# EasyEDA Pro project STM32F103C8T6-V2.0最小系统板.epro

# Schematic Schematic1

## Sheets
1 core: Board Name: 最小系统板; Create Date: 2025-08-06; Page Name: core; Project Name: STM32F103C8T6最小系统板_V2.0; Schematic Name: Schematic1; Update Date: 2025-09-07; Company: 嘉立创EDA; Page Size: A4; Version: V1.0
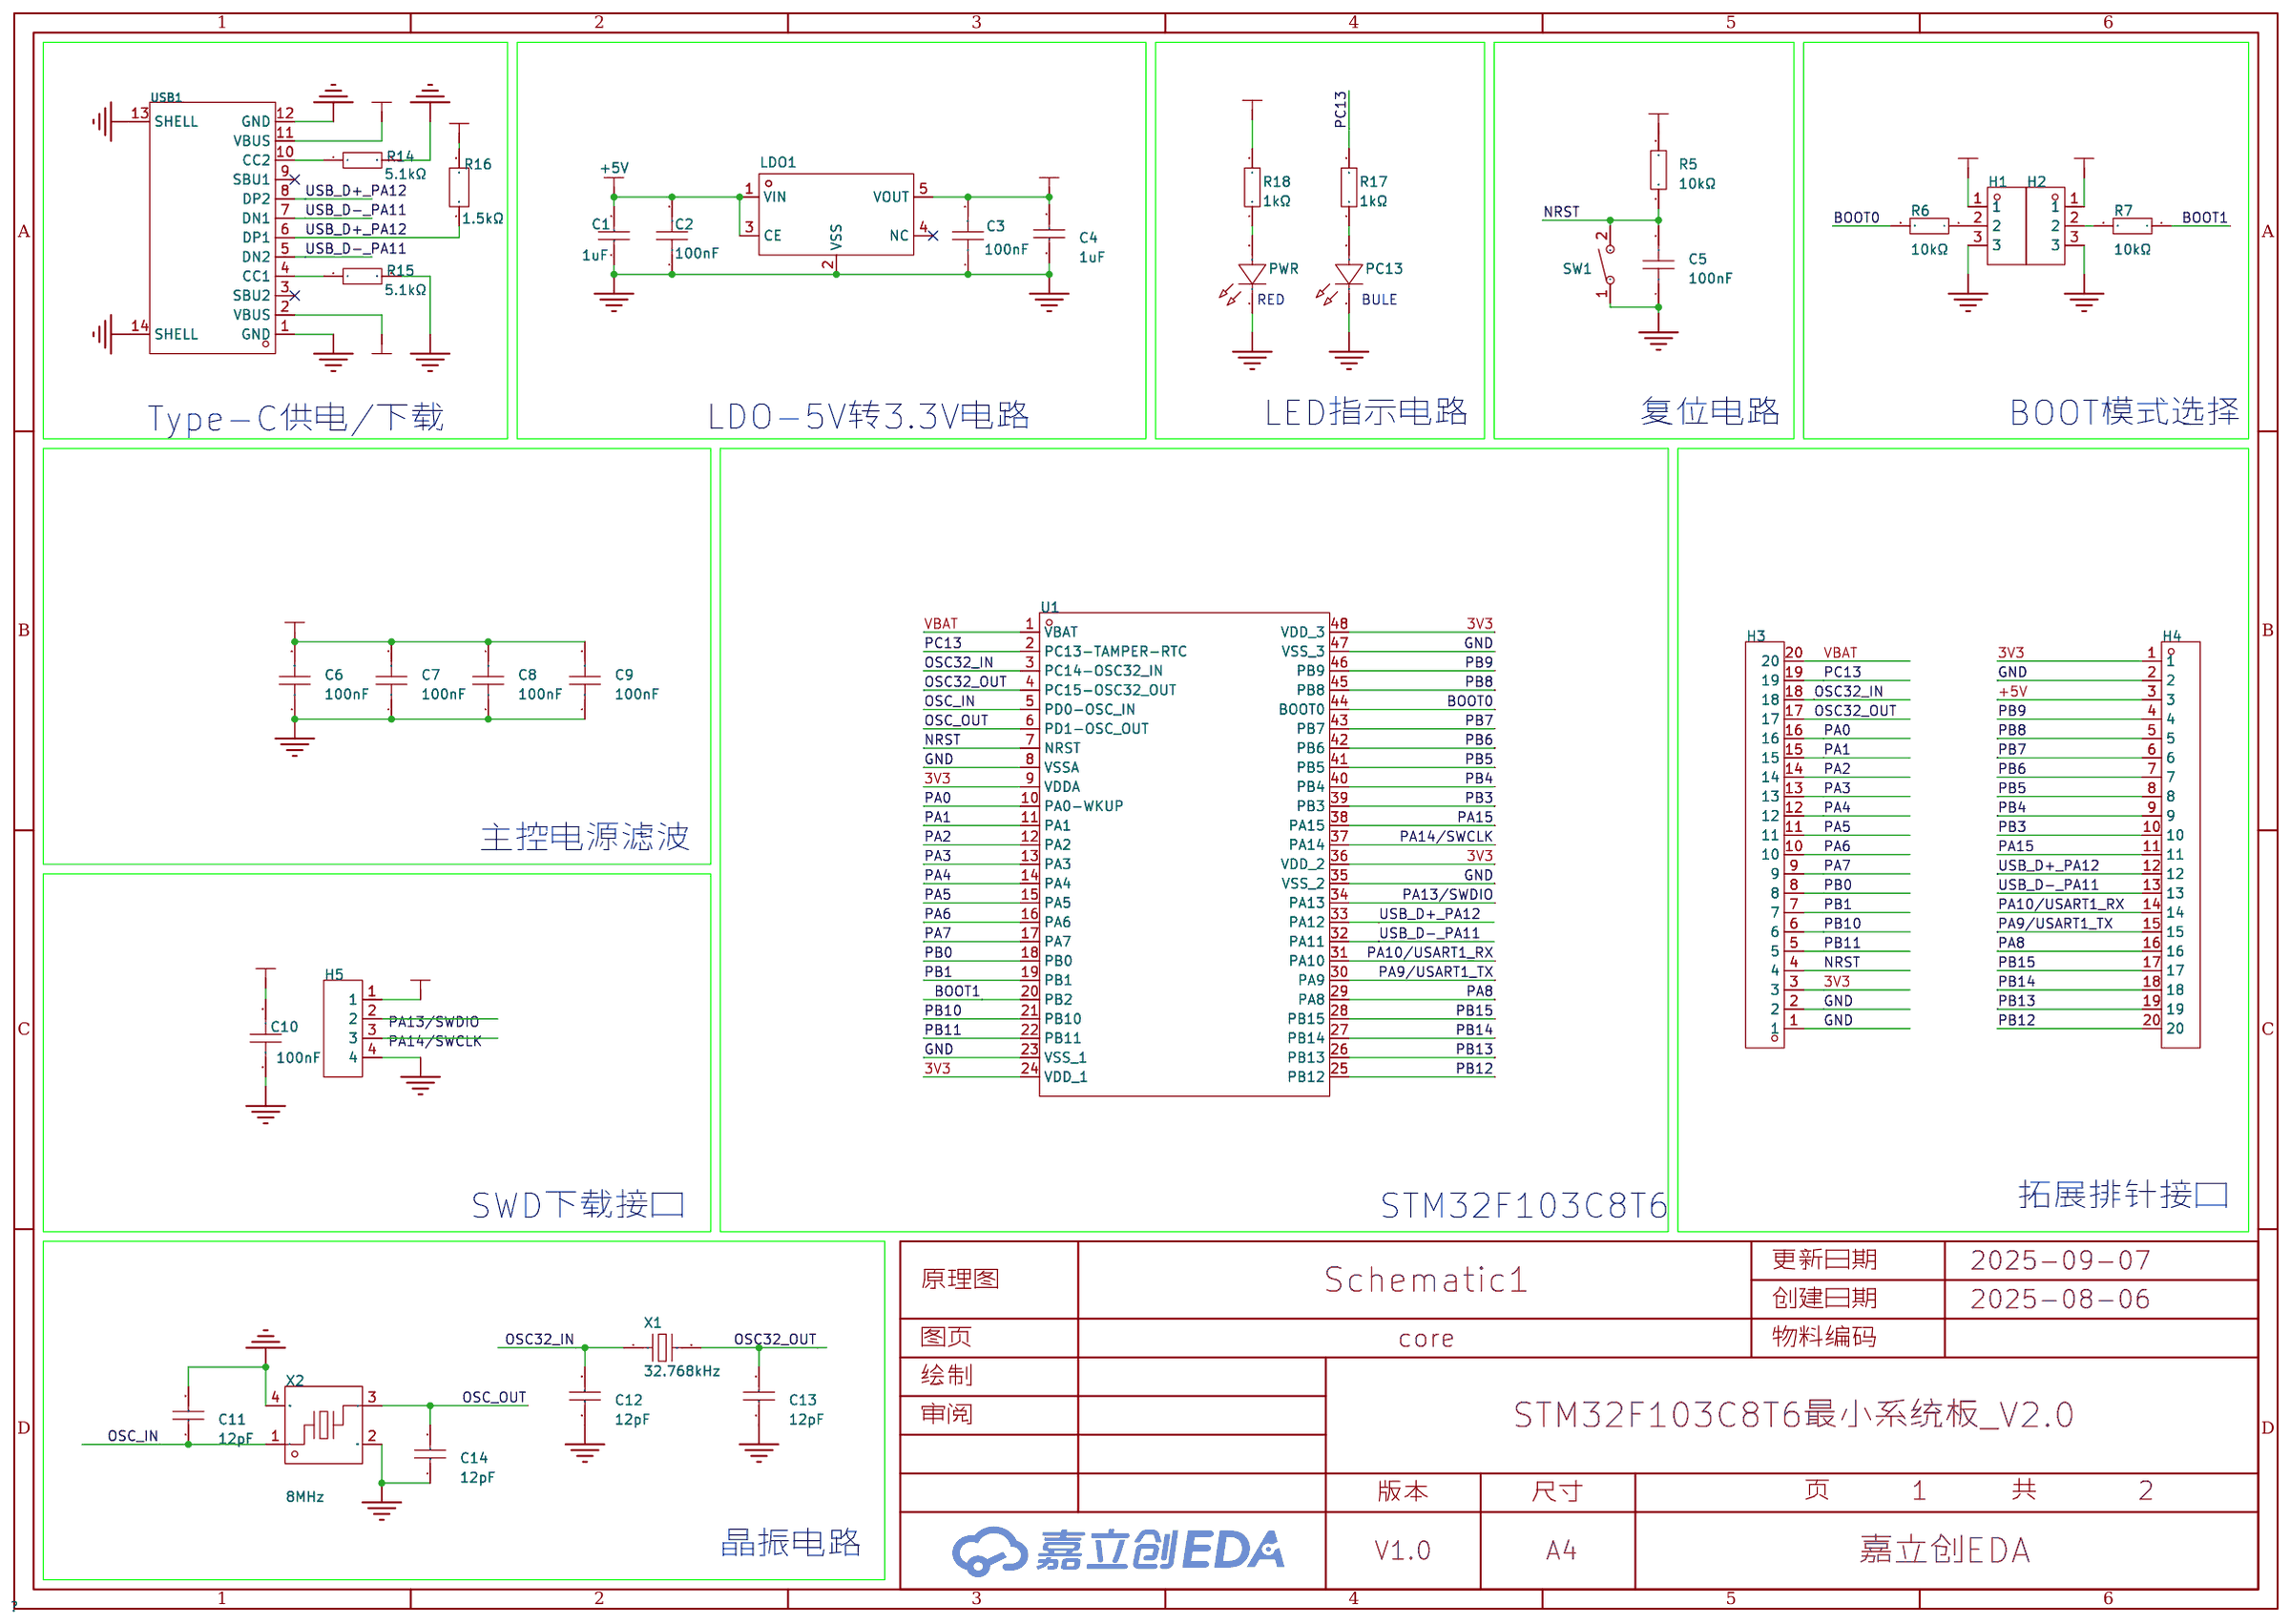
[diagram p0: core]
2 expand: Page Name: expand; Update Date: 2025-09-09
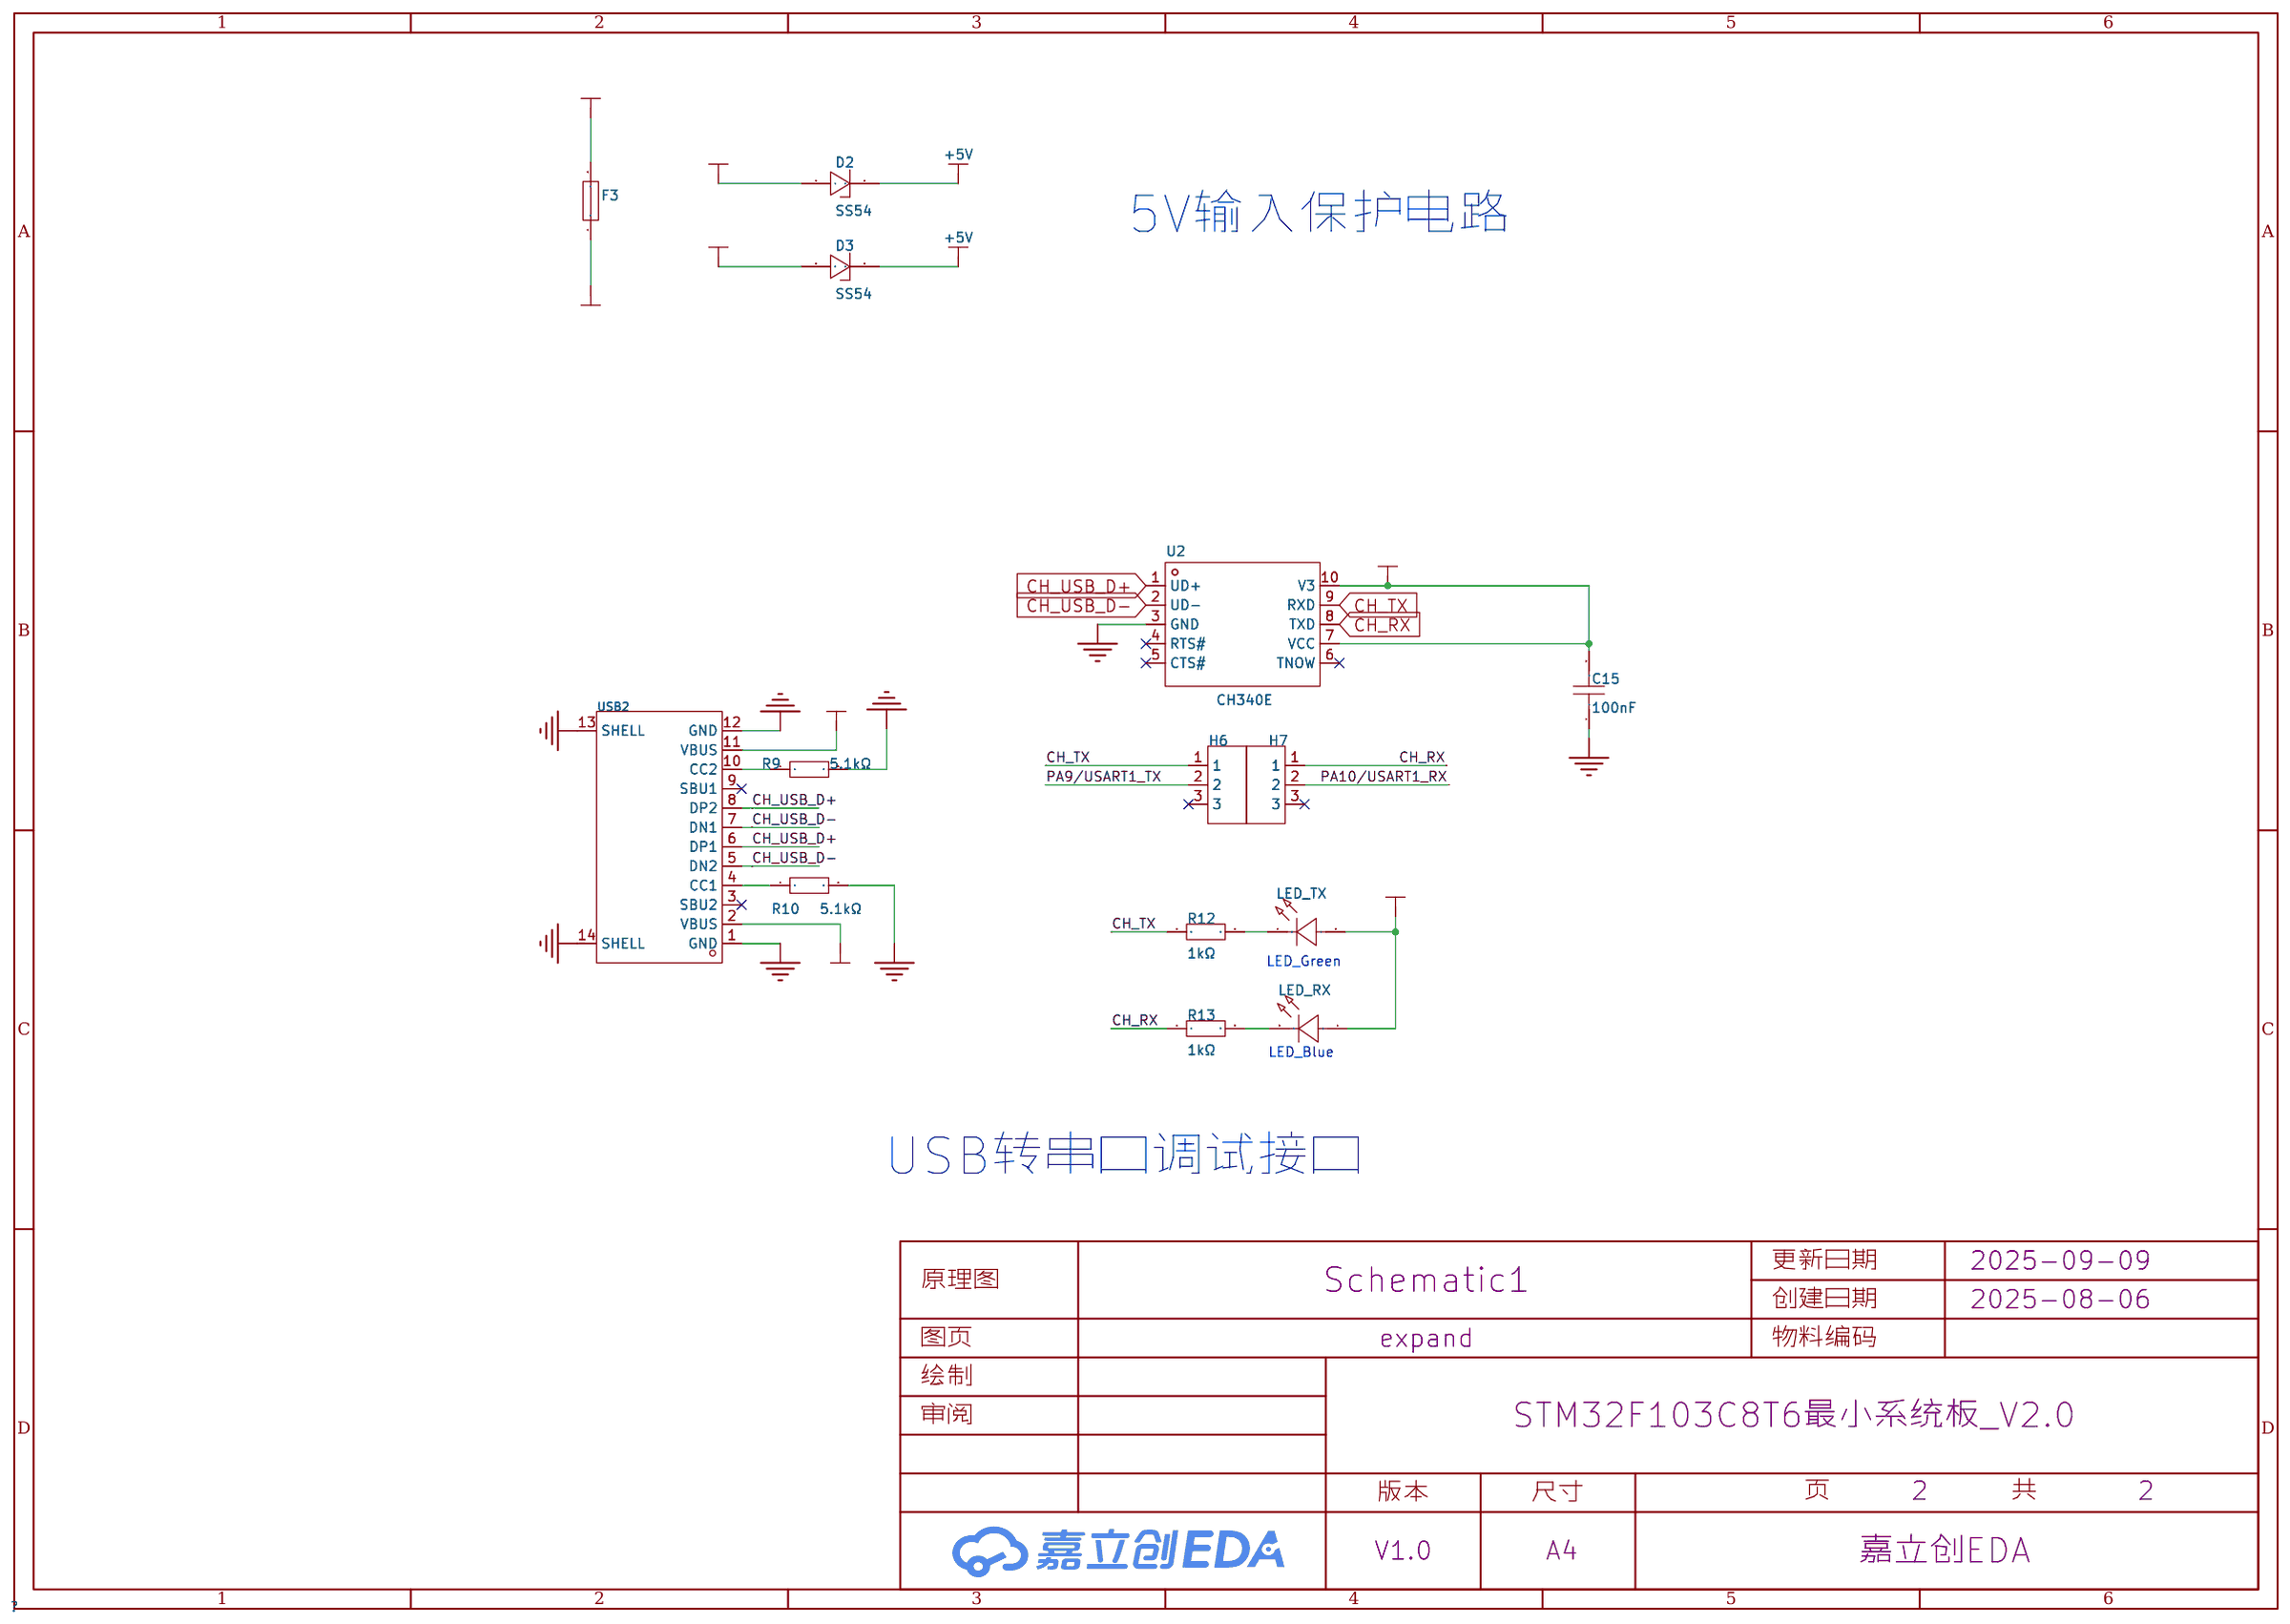
[diagram p1: expand]

## Parts
sheet core
C1  1uF  [C0805]
C2  100nF  [C0805]
C3  100nF  [C0805]
C4  1uF  [C0805]
C5  100nF  [C0805]
C6  100nF  [C0805]
C7  100nF  [C0805]
C8  100nF  [C0805]
C9  100nF  [C0805]
C10  100nF  [C0805]
C11  12pF  [C0402]
C12  12pF  [C0402]
C13  12pF  [C0402]
C14  12pF  [C0402]
H1  PZ254V-11-03P  [HDR-TH_3P-P2.54-V-M]
H2  PZ254V-11-03P  [HDR-TH_3P-P2.54-V-M]
H3  PH2.54-01-20PZD  [HDR-TH_20P-P2.54-V-M-4]
H4  PH2.54-01-20PZD  [HDR-TH_20P-P2.54-V-M-4]
H5  PZ2.54-1*4-WZ  [HDR-TH_4P-P2.54-H-M-W7.7-P]
LDO1  ME6211C33M5G-N  [SOT-23-5_L3.0-W1.7-P0.95-LS2.8-BL]
PC13  XL-2012UBC  [LED0805-RD]
PWR  XL-2012SURC  [LED0805-RD_RED]
R5  10kΩ  [R0805]
R6  10kΩ  [R0805]
R7  10kΩ  [R0805]
R14  5.1kΩ  [R0805]
R15  5.1kΩ  [R0805]
R16  1.5kΩ  [R0805]
R17  1kΩ  [R0805]
R18  1kΩ  [R0805]
SW1  TS-1101-B-W  [KEY-SMD_2P-L6.0-W3.6-P7.4-LS8.0-L]
U1  STM32F103C8T6  [LQFP-48_L7.0-W7.0-P0.50-LS9.0-BL]
USB1  TYPE-C 16PIN 2MD(073)  [USB-C-SMD_TYPE-C-6PIN-2MD-073]
X1  32.768kHz  [OSC-SMD_L3.2-W1.5]
X2  8MHz  [CRYSTAL-SMD_4P-L3.2-W2.5-BL-1]
sheet expand
C15  100nF  [C0805]
D2  SS54  [SMA_L4.3-W2.6-LS5.0-FD]
D3  SS54  [SMA_L4.3-W2.6-LS5.0-FD]
F3  BSMD0805-050-6V  [F0805]
H6  PZ254V-11-03P  [HDR-TH_3P-P2.54-V-M]
H7  PZ254V-11-03P  [HDR-TH_3P-P2.54-V-M]
LED_RX  XL-1608UBC-06A  [LED0603-R-RD]
LED_TX  XL-1608PGC-06  [LED0603-RD_GREEN]
R9  5.1kΩ  [R0805]
R10  5.1kΩ  [R0805]
R12  1kΩ  [R0805]
R13  1kΩ  [R0805]
U2  CH340E  [MSOP-10_L3.0-W3.0-P0.50-LS5.0-BL]
USB2  TYPE-C 16PIN 2MD(073)  [USB-C-SMD_TYPE-C-6PIN-2MD-073]

## Library data of the parts
C1 C4 = CL21B105KBFNNNE: 容值:1uF;精度:±10%;额定电压:50V;材质(温度系数):X7R;; LCSC Part Name: 1uF ±10% 50V; Supplier Part: C28323; Manufacturer: SAMSUNG(三星); Supplier Footprint: 0805; JLCPCB Part Class: Basic Part; Datasheet: https://atta.szlcsc.com/upload/public/pdf/source/20160218/1457707763339.pdf; Supplier: LCSC; Tolerance: ±10%; Voltage Rated: 50V; Temperature Coefficient: X7R
C2 C3 C5-C10 C15 = CC0805KRX7R9BB104: 容值:100nF;精度:±10%;额定电压:50V;材质(温度系数):X7R;; LCSC Part Name: 100nF ±10% 50V; Supplier Part: C49678; Manufacturer: YAGEO(国巨); Supplier Footprint: 0805; JLCPCB Part Class: Basic Part; Datasheet: https://atta.szlcsc.com/upload/public/pdf/source/20180224/C181747_15194369449651363981.pdf; Supplier: LCSC; Tolerance: ±10%; Voltage Rated: 50V; Temperature Coefficient: X7R
C11-C14 = 0402CG120J500NT: 容值:12pF;精度:±5%;额定电压:50V;材质(温度系数):C0G;; LCSC Part Name: 12pF ±5% 50V; Supplier Part: C1547; Manufacturer: FH(风华); Supplier Footprint: 0402; JLCPCB Part Class: Basic Part; Datasheet: https://atta.szlcsc.com/upload/public/pdf/source/20200305/C486355_26A10D38EF8C2A5C37091D0039909270.pdf; Supplier: LCSC; Tolerance: ±5%; Voltage Rated: 50V; Temperature Coefficient: C0G
H1 H2 H6 H7 = PZ254V-11-03P: 插针结构:1x3P;间距:2.54mm;行距:-;圆针/方针:方针;安装方式:直插;排数:单排;总PIN位数:3P;额定电流:3A;额定电压:250V;配合针长度:6mm;塑高:2.5mm;端接针长度:3mm;工作温度:-40℃~+105℃;颜色:黑色;; LCSC Part Name: 1x3P 间距:2.54mm 方针 直插; Supplier Part: C2937625; Manufacturer: XFCN(兴飞); Supplier Footprint: 插件,P=2.54mm; JLCPCB Part Class: 扩展库; Datasheet: https://atta.szlcsc.com/upload/public/pdf/source/20200309/C492402_8335C3D49C4E4C618838D59BB1D024C1.pdf; Supplier: LCSC; Pin Structure: 1x3P; Pitch: 2.54mm; Circluar Pins/Square Pins: 方针; Mounting Type: 直插; Number of Rows: 单排; Number of Pins: 3P; Current Rating: 3A; Voltage Rating (Max): 250V; Length of Mating Pin: 6mm; Insulation Height: 2.5mm; Length of End Connection Pin: 3mm; Operating Temperature: -40℃~+105℃; Color: 黑色
H3 H4 = PH2.54-01-20PZD: 插针结构:1x20P;间距:2.54mm;圆针/方针:方针;安装方式:直插;排数:单排;总PIN位数:20P;配合针长度:6mm;塑高:2.5mm;端接针长度:3mm;触头材质:黄铜;工作温度:-40℃~+105℃;颜色:黑色;; LCSC Part Name: 1x20P 间距:2.54mm 方针 直插; Supplier Part: C7501591; Manufacturer: XUNPU(讯普); Supplier Footprint: 插件,P=2.54mm; JLCPCB Part Class: Extended Part; Datasheet: https://atta.szlcsc.com/upload/public/pdf/source/20230815/30A24B1E4B9BDE2239C7F8E56770F33B.pdf; Supplier: LCSC; Pin Structure: 1x20P; Pitch: 2.54mm; Circluar Pins/Square Pins: 方针; Mounting Type: 直插; Number of Rows: 单排; Number of Pins: 20P; Length of Mating Pin: 6mm; Insulation Height: 2.5mm; Length of End Connection Pin: 3mm; Contact Material: 黄铜; Operating Temperature: -40℃~+105℃; Color: 黑色
H5 = PZ2.54-1*4-WZ: 插针结构:1x4P;间距:2.54mm;安装方式:弯插;排数:单排;总PIN位数:4P;触头镀层:金;; LCSC Part Name: 1x4P 间距:2.54mm 弯插; Supplier Part: C5224015; Manufacturer: ZHOURI(洲日); Supplier Footprint: 弯插,P=2.54mm; JLCPCB Part Class: 扩展库; Datasheet: https://atta.szlcsc.com/upload/public/pdf/source/20221031/5E07F614DEAC37F80EB82945E6A3298C.pdf; Supplier: LCSC; Pin Structure: 1x4P; Pitch: 2.54mm; Mounting Type: 弯插; Number of Rows: 单排; Number of Pins: 4P; Contact Plating: 金
LDO1 = ME6211C33M5G-N: 输出类型:固定;输出极性:正;最大输入电压:6V;输出电压:3.3V;输出电流:500mA;电源纹波抑制比(PSRR):70dB;; Supplier Part: C82942; Manufacturer: MICRONE(南京微盟); Supplier Footprint: SOT-23-5; JLCPCB Part Class: 扩展库; Datasheet: https://atta.szlcsc.com/upload/public/pdf/source/20170918/C82942_1505727073070976520.pdf; Supplier: LCSC; Output Type: 固定; Output Polarity: 正; Number of Outputs: 1; Maximum Input Voltage: 6V; Output Voltage: 3.3V; Dropout Voltage: 260mV@(200mA); Output Current: 500mA; Power Supply Rejection Ratio (PSRR): 70dB
PC13 = XL-2012UBC: 灯头类型:-;发光颜色:蓝色;正向压降(Vf):3.2V;功率:70mW;正向电流:20mA;波长:460nm~475nm;二极管配置:-;透镜颜色:无色透明透镜;色温:-;发光强度:260mcd;发光角度:120°;载带方式:正贴;工作温度:-;; Supplier Part: C965817; Manufacturer: XINGLIGHT(成兴光); Supplier Footprint: 0805; JLCPCB Part Class: 扩展库; Datasheet: https://item.szlcsc.com/datasheet/XL-2012UBC/1051426.html; Supplier: LCSC; Illumination Color: 蓝色; Voltage - Forward(Vf): 3.2V; Power(Watts): 70mW; Forward Current: 20mA; Wavelength - Dominant: 460nm~475nm; Peak Wavelength: 470nm; Lens Color: 无色透明透镜; Luminous Intensity: 260mcd; Viewing Angle: 120°; Mounting Style: 正贴
PWR = XL-2012SURC: 发光颜色:红色;功率:55mW;正向电流:25mA;主波长:617nm~621nm;透镜颜色:无色透明透镜;色温:-;发光角度:120°;载带方式:正贴;工作温度:-30℃~+85℃;; Supplier Part: C965812; Manufacturer: XINGLIGHT(成兴光); Supplier Footprint: 0805; JLCPCB Part Class: 扩展库; Datasheet: https://atta.szlcsc.com/upload/public/pdf/source/20221102/49E1A0A365644091E6270AF1C5E0FE37.pdf; Supplier: LCSC; Emitted Color: 红色; Power Dissipation: 55mW; Forward Current: 25mA; Dominant Wavelength: 617nm~621nm; Peak Wavelength: 623nm; Lens Color: 无色透明透镜; Viewing Angle: 120°; Mounting Sytle: 正贴; Operating Temperature: -30℃~+85℃
R5-R7 = 0805W8F1002T5E_C17414: 电阻类型:厚膜电阻;阻值:10kΩ;精度:±1%;功率:125mW;工作电压:150V;温度系数:±100ppm/℃;; LCSC Part Name: 10kΩ ±1% 125mW 厚膜电阻; Supplier Part: C17414; Manufacturer: UNI-ROYAL(厚声); Manufacturer Part: 0805W8F1002T5E; Supplier Footprint: 0805; JLCPCB Part Class: Basic Part; Datasheet: https://atta.szlcsc.com/upload/public/pdf/source/20200306/C422600_1E6D84923E4A46A82E41ADD87F860B5C.pdf; Supplier: LCSC; Type: 厚膜电阻; Tolerance: ±1%; Power(Watts): 125mW; Voltage-Supply(Max): 150V; Temperature Coefficient: ±100ppm/℃; Operating Temperature: -55℃~+155℃; Overload Voltage (Max): 50V; Operating Temperature Range: -55℃~+155℃
R14 R15 = 0805W8F5101T5E: 电阻类型:厚膜电阻;阻值:5.1kΩ;精度:±1%;功率:125mW;最大工作电压:150V;温度系数:±100ppm/℃;; LCSC Part Name: 5.1kΩ ±1% 125mW 厚膜电阻; Supplier Part: C27834; Manufacturer: UNI-ROYAL(厚声); Supplier Footprint: 0805; JLCPCB Part Class: 基础库; Datasheet: https://atta.szlcsc.com/upload/public/pdf/source/20200306/C422600_1E6D84923E4A46A82E41ADD87F860B5C.pdf; Supplier: LCSC; Type: 厚膜电阻; Tolerance: ±1%; Power(Watts): 125mW; Overload Voltage (Max): 150V; Temperature Coefficient: ±100ppm/℃; Operating Temperature Range: -55℃~+155℃
R16 = FRC0805F1501TS: 电阻类型:厚膜电阻;阻值:1.5kΩ;精度:±1%;功率:125mW;工作电压:150V;温度系数:±100ppm/℃;; LCSC Part Name: 1.5kΩ ±1% 125mW 厚膜电阻; Supplier Part: C2907216; Manufacturer: FOJAN(富捷); Supplier Footprint: 0805; JLCPCB Part Class: 扩展库; Datasheet: https://atta.szlcsc.com/upload/public/pdf/source/20211221/925EC7D7225764EE0046F22065062C87.pdf; Supplier: LCSC; Type: 厚膜电阻; Tolerance: ±1%; Power(Watts): 125mW; Voltage-Supply(Max): 150V; Temperature Coefficient: ±100ppm/℃; Operating Temperature: -55℃~+155℃
R17 R18 = 0805W8F1001T5E: 电阻类型:厚膜电阻;阻值:1kΩ;精度:±1%;功率:125mW;最大工作电压:150V;温度系数:±100ppm/℃;; LCSC Part Name: 1kΩ ±1% 125mW 厚膜电阻; Supplier Part: C17513; Manufacturer: UNI-ROYAL(厚声); Supplier Footprint: 0805; JLCPCB Part Class: 基础库; Datasheet: https://atta.szlcsc.com/upload/public/pdf/source/20200306/C422600_1E6D84923E4A46A82E41ADD87F860B5C.pdf; Supplier: LCSC; Type: 厚膜电阻; Tolerance: ±1%; Power(Watts): 125mW; Overload Voltage (Max): 150V; Temperature Coefficient: ±100ppm/℃; Operating Temperature Range: -55℃~+155℃
SW1 = TS-1101-B-W_C500065: 触点电流:50mA;额定电压(DC):12V;绝缘电阻:-;电路结构:单刀单掷;安装方式:立贴;带灯:无;作用力:160gf;机械寿命:5万次;带支架:否;; LCSC Part Name: 6*3.6*2.5mm 立贴 轻触开关; Supplier Part: C500065; Manufacturer: XKB Connectivity(中国星坤); Supplier Footprint: SMD; JLCPCB Part Class: 扩展库; Datasheet: https://atta.szlcsc.com/upload/public/pdf/source/20211011/D0E0CAF534F7B19DDE4CE68748A25BD3.pdf; Supplier: LCSC; Contact Current: 50mA; Voltage Rating (DC): 12V; Circuit: 单刀单掷; Mounting Style: 立贴; Actuator Style: 矩形按钮; Actuator/Cap Color: 白色; With Lamp: 无; Operating Force: 160gf; Mechanical Life: 5万次; Operating Temperature: -30℃~+85℃; Switch Length: 6mm; Switch Width: 3.6mm; Switch Height: 2.5mm; Strike Gundam: 否
U1 = STM32F103C8T6: CPU内核:ARM-M3;CPU最大主频:72MHz;应用领域:-;; LCSC Part Name: 主流增强型ARM Cortex-M3 MCU，具有64 KB Flash、72 MHz CPU、电机控制、USB和CAN; Supplier Part: C8734; Manufacturer: ST(意法半导体); Supplier Footprint: LQFP-48(7x7); JLCPCB Part Class: 扩展库; Datasheet: https://atta.szlcsc.com/upload/public/pdf/source/20220812/8363ACEC51AD55ECEB84799464F7CB85.pdf; Supplier: LCSC; CPU Core: ARM-M3; CPU Maximum Speed: 72MHz; Program Storage Size: 64KB; Program Memory Type: FLASH; Number of I/O: 37; ADC (Bit): 12bit; Voltage - Supply: 2V~3.6V; RAM Size: 20KB; GPIO Ports Number: 37; Operating Voltage Range: 2V~3.6V; Operating Temperature Range: -40℃~+85℃; Universal Serial Bus: 有; Peripheral/Function: 看门狗；DMA；看门狗；片载温度传感器; Watchdog: 有; Infrared Data Association: 有; Low-Voltage Detect: 有; Direct Memory Access: 有; Internal Oscillator: 有
USB1 USB2 = TYPE-C 16PIN 2MD(073): 连接器类型:Type-C;标准:-;公母:母座;触点数量:16;端口数量:1;安装方式:卧贴;额定电流 - 电源:5A;工作温度范围:-25℃~+85℃;; LCSC Part Name: TYPE-C母座 16P 4脚插件带定位柱 不锈钢外壳 2次模顶; Supplier Part: C2765186; Manufacturer: SHOU HAN(首韩); Supplier Footprint: SMD; JLCPCB Part Class: 扩展库; Supplier: LCSC; Connector Type: Type-C; Gender: 母座; Number of Contacts: 16; Number of Ports: 1; Mounting Style: 卧贴; Current Rating - Power (Max): 5A; Operating Temperature Range: -25℃~+85℃
X1 = X321532768KGD2SI: 晶振类型:贴片晶振;频率:32.768kHz;常温频差:±20ppm;外接负载电容:12.5pF;频率稳定度(全温):-;; LCSC Part Name: 32.768kHz ±20ppm 12.5pF; Supplier Part: F; Manufacturer: YXC(扬兴晶振); Supplier Footprint: SMD3215-2P; JLCPCB Part Class: 扩展库; Datasheet: https://atta.szlcsc.com/upload/public/pdf/source/20240329/3A7650FD985DD0DE85694D3785AB4916.pdf; Supplier: LCSC; Crystal Type: 贴片晶振; Normal temperature Frequency Tolerance: ±20ppm; External load capacitor: 12.5pF; Operating Temperature: -40℃~+85℃
X2 = XL2EL89COI-111YLC-8M: 晶振类型:贴片晶振;频率:8MHz;常温频差:±10ppm;外接负载电容:12pF;频率稳定度(全温):±20ppm;; LCSC Part Name: 8MHz ±10ppm 12pF; Supplier Part: C2973805; Manufacturer: YXC(扬兴晶振); Supplier Footprint: SMD3225-4P; JLCPCB Part Class: 扩展库; Datasheet: https://atta.szlcsc.com/upload/public/pdf/source/20240329/19D5F850207469550BEB00D7DFEDBC7A.pdf; Supplier: LCSC; Crystal Type: 贴片晶振; Normal temperature Frequency Tolerance: ±10ppm; External load capacitor: 12pF; Frequency Stability(Full temperature range): ±20ppm; Equivalent Series Resistance (ESR): 150Ω; Operating Temperature: -40℃~+85℃
D2 D3 = SS54_C7420369: 二极管配置:独立式;正向压降(Vf):550mV@5.0A;直流反向耐压(Vr):40V;整流电流:5A;; LCSC Part Name: 电压:40V 电流:5A; Supplier Part: C7420369; Manufacturer: R+O(宏嘉诚); Supplier Footprint: SMA(DO-214AC); JLCPCB Part Class: Extended Part; Datasheet: https://item.szlcsc.com/datasheet/SS54/8397191.html; Supplier: LCSC; Diode Configuration: 独立式; Forward Voltage (Vf@If): 550mV@5.0A; Reverse Voltage (Vr): 40V; Rectified Current: 5A; Reverse Leakage Current (Ir): 50uA@40V; Voltage - Forward(Vf@If): 550mV@5.0A; Voltage - DC Reverse(Vr): 40V; Current - Rectified: 5A; Operating Junction Temperature Range: -55℃~+125℃; Non-Repetitive Peak Forward Surge Current: 120A
F3 = BSMD0805-050-6V: 耐压(Vmax):6V;最大电流(Imax):40A;保持电流(Ihold):500mA;跳闸电流(Itrip):1A;; LCSC Part Name: 6V 500mA 0805自恢复; Supplier Part: C883108; Manufacturer: BHFUSE(佰宏); Supplier Footprint: 0805; JLCPCB Part Class: Extended Part; Datasheet: https://item.szlcsc.com/datasheet/BSMD0805-050-6V/947783.html; Supplier: LCSC; Voltage - Max: 6V; Current - Max: 40A; Hold Current: 500mA; Trip Current: 1A; Power Dissipation: 500mW; Resistance - Initial (Ri) (Min): 100mΩ; Resistance - Post Trip (R1) (Max): 850mΩ; Time to Trip(Max): 100ms; Operating Temperature: -40℃~+85℃
LED_RX = XL-1608UBC-06A: 灯头类型:-;发光颜色:蓝色;正向压降(Vf):2.6V~3V;功率:-;正向电流:5mA;波长:456nm~476nm;二极管配置:-;透镜颜色:无色透明透镜;色温:-;发光强度:-;发光角度:130°;载带方式:正贴;工作温度:-;; Supplier Part: C7371904; Manufacturer: XINGLIGHT(成兴光); Supplier Footprint: 0603; JLCPCB Part Class: 扩展库; Datasheet: https://item.szlcsc.com/datasheet/XL-1608UBC-06A/8342976.html; Supplier: LCSC; Illumination Color: 蓝色; Voltage - Forward(Vf): 2.6V~3V; Forward Current: 5mA; Wavelength - Dominant: 456nm~476nm; Lens Color: 无色透明透镜; Viewing Angle: 130°; Mounting Sytle: 正贴
LED_TX = XL-1608PGC-06: 灯头类型:-;发光颜色:翠绿色;正向电压(VF):2.6V~3V;功率:75mW;正向电流:5mA;主波长:505nm~540nm;二极管配置:-;透镜颜色:绿色透镜;色温:-;发光强度:299mcd;发光角度:130°;载带方式:正贴;工作温度:-;; Supplier Part: C7371905; Manufacturer: XINGLIGHT(成兴光); Supplier Footprint: 0603; JLCPCB Part Class: 扩展库; Datasheet: https://atta.szlcsc.com/upload/public/pdf/source/20240218/2F8A7AF596DEEB38157DAB7856E382C0.pdf; Supplier: LCSC; Emitted Color: 翠绿色; Forward Voltage (VF): 2.6V~3V; Power Dissipation: 75mW; Forward Current: 5mA; Dominant Wavelength: 505nm~540nm; Peak Wavelength: 530nm; Lens Color: 绿色透镜; Luminous Intensity: 299mcd; Viewing Angle: 130°; Mounting Sytle: 正贴
R9 R10 = 0805W8F5101T5E: 电阻类型:厚膜电阻;阻值:5.1kΩ;精度:±1%;功率:125mW;最大工作电压:150V;温度系数:±100ppm/℃;; LCSC Part Name: 5.1kΩ ±1% 125mW 厚膜电阻; Supplier Part: C27834; Manufacturer: UNI-ROYAL(厚声); Supplier Footprint: 0805; JLCPCB Part Class: Basic Part; Datasheet: https://atta.szlcsc.com/upload/public/pdf/source/20200306/C422600_1E6D84923E4A46A82E41ADD87F860B5C.pdf; Supplier: LCSC; Type: 厚膜电阻; Tolerance: ±1%; Power(Watts): 125mW; Overload Voltage (Max): 150V; Temperature Coefficient: ±100ppm/℃; Operating Temperature Range: -55℃~+155℃
R12 R13 = 0805W8F1001T5E: 电阻类型:厚膜电阻;阻值:1kΩ;精度:±1%;功率:125mW;最大工作电压:150V;温度系数:±100ppm/℃;; LCSC Part Name: 1kΩ ±1% 125mW 厚膜电阻; Supplier Part: C17513; Manufacturer: UNI-ROYAL(厚声); Supplier Footprint: 0805; JLCPCB Part Class: Basic Part; Datasheet: https://atta.szlcsc.com/upload/public/pdf/source/20200306/C422600_1E6D84923E4A46A82E41ADD87F860B5C.pdf; Supplier: LCSC; Type: 厚膜电阻; Tolerance: ±1%; Power(Watts): 125mW; Overload Voltage (Max): 150V; Temperature Coefficient: ±100ppm/℃; Operating Temperature Range: -55℃~+155℃
U2 = CH340E: 应用功能:收发器;接口协议:USB 2.0;数据速率:2Mbps;; Protocol: USB 2.0; Supplier: LCSC; Data Rate: 2Mbps; Datasheet: https://atta.szlcsc.com/upload/public/pdf/source/20200819/C99652_97FFC0DF2539BFF05CD752AD9221D632.pdf; Manufacturer: WCH(南京沁恒); Supplier Part: C99652; LCSC Part Name: USB转串口芯片 CH340; Supply Voltage: 3.3V；5V; JLCPCB Part Class: Extended Part; Supplier Footprint: MSOP-10; Applications Function: 收发器

## Nets
3V3: C3.2 C4.2 C6.2 C7.2 C8.2 C9.2 C10.2 C15.2 H1.1 H2.1 H3.3 H4.1 H5.1 LDO1.5(VOUT) LED_RX.1(A) LED_TX.2(A) R5.2 R16.2 R18.2 U1.9(VDDA) U1.24(VDD_1) U1.36(VDD_2) U1.48(VDD_3) U2.7(VCC) U2.10(V3)
+5V: C1.2 C2.2 D2.2(K) D3.2(K) H4.3 LDO1.1(VIN) LDO1.3(CE)
GND: C1.1 C2.1 C3.1 C4.1 C5.1 C6.1 C7.1 C8.1 C9.1 C10.1 C11.2 C12.1 C13.1 C14.1 C15.1 H1.3 H2.3 H3.1 H3.2 H4.2 H5.4 LDO1.2(VSS) PC13.1(K) PWR.1(K) R9.2 R10.2 R14.2 R15.2 SW1.1 U1.8(VSSA) U1.23(VSS_1) U1.35(VSS_2) U1.47(VSS_3) U2.3(GND) USB1.1(GND) USB1.12(GND) USB1.13(SHELL) USB1.14(SHELL) USB2.1(GND) USB2.12(GND) USB2.13(SHELL) USB2.14(SHELL) X2.2(GND) X2.4(GND)
VBAT: H3.20 U1.1(VBAT)
VBUS_5V: F3.2 USB1.2(VBUS) USB1.11(VBUS) USB2.2(VBUS) USB2.11(VBUS)
BOOT0: R6.2 U1.44(BOOT0)
BOOT1: R7.1 U1.20(PB2)
CH_RX: H7.1 R13.1 U2.8(TXD)
CH_TX: H6.1 R12.1 U2.9(RXD)
CH_USB_D+: U2.1(UD+) USB2.6(DP1) USB2.8(DP2)
CH_USB_D-: U2.2(UD-) USB2.5(DN2) USB2.7(DN1)
IN_5V: D2.1(A) D3.1(A) F3.1
NRST: C5.2 H3.4 R5.1 SW1.2 U1.7(NRST)
OSC32_IN: C12.2 H3.18 U1.3(PC14-OSC32_IN) X1.1
OSC32_OUT: C13.2 H3.17 U1.4(PC15-OSC32_OUT) X1.2
OSC_IN: C11.1 U1.5(PD0-OSC_IN) X2.1
OSC_OUT: C14.2 U1.6(PD1-OSC_OUT) X2.3
PA0: H3.16 U1.10(PA0-WKUP)
PA1: H3.15 U1.11(PA1)
PA2: H3.14 U1.12(PA2)
PA3: H3.13 U1.13(PA3)
PA4: H3.12 U1.14(PA4)
PA5: H3.11 U1.15(PA5)
PA6: H3.10 U1.16(PA6)
PA7: H3.9 U1.17(PA7)
PA8: H4.16 U1.29(PA8)
PA9/USART1_TX: H4.15 H6.2 U1.30(PA9)
PA10/USART1_RX: H4.14 H7.2 U1.31(PA10)
PA13/SWDIO: H5.2 U1.34(PA13)
PA14/SWCLK: H5.3 U1.37(PA14)
PA15: H4.11 U1.38(PA15)
PB0: H3.8 U1.18(PB0)
PB1: H3.7 U1.19(PB1)
PB3: H4.10 U1.39(PB3)
PB4: H4.9 U1.40(PB4)
PB5: H4.8 U1.41(PB5)
PB6: H4.7 U1.42(PB6)
PB7: H4.6 U1.43(PB7)
PB8: H4.5 U1.45(PB8)
PB9: H4.4 U1.46(PB9)
PB10: H3.6 U1.21(PB10)
PB11: H3.5 U1.22(PB11)
PB12: H4.20 U1.25(PB12)
PB13: H4.19 U1.26(PB13)
PB14: H4.18 U1.27(PB14)
PB15: H4.17 U1.28(PB15)
PC13: H3.19 R17.2 U1.2(PC13-TAMPER-RTC)
USB_D+_PA12: H4.12 R16.1 U1.33(PA12) USB1.6(DP1) USB1.8(DP2)
USB_D-_PA11: H4.13 U1.32(PA11) USB1.5(DN2) USB1.7(DN1)
$1N2343: PWR.2(A) R18.1
$1N2346: PC13.2(A) R17.1
$1N2538: H2.2 R7.2
$1N2559: H1.2 R6.1
Net-(LED_RX-2): LED_RX.2(K) R13.2
Net-(LED_TX-1): LED_TX.1(K) R12.2
Net-(R9-1): R9.1 USB2.10(CC2)
Net-(R10-1): R10.1 USB2.4(CC1)
Net-(R14-1): R14.1 USB1.10(CC2)
Net-(R15-1): R15.1 USB1.4(CC1)

Not connected (* = marked no-connect by the designer): H6 3*; H7 3*; LDO1 4(NC)*; U2 4(RTS#)* 5(CTS#)* 6(TNOW)*; USB1 3(SBU2)* 9(SBU1)*; USB2 3(SBU2)* 9(SBU1)*

## Notes on the sheets
sheet 1
- RED
- BULE
- Type-C供电/下载
- LDO-5V转3.3V电路
- LED指示电路
- 复位电路
- BOOT模式选择
- 主控电源滤波
- 拓展排针接口
- SWD下载接口
- STM32F103C8T6
- 晶振电路
sheet 2
- 5V输入保护电路
- LED_Green
- LED_Blue
- USB转串口调试接口

# Board PCB1
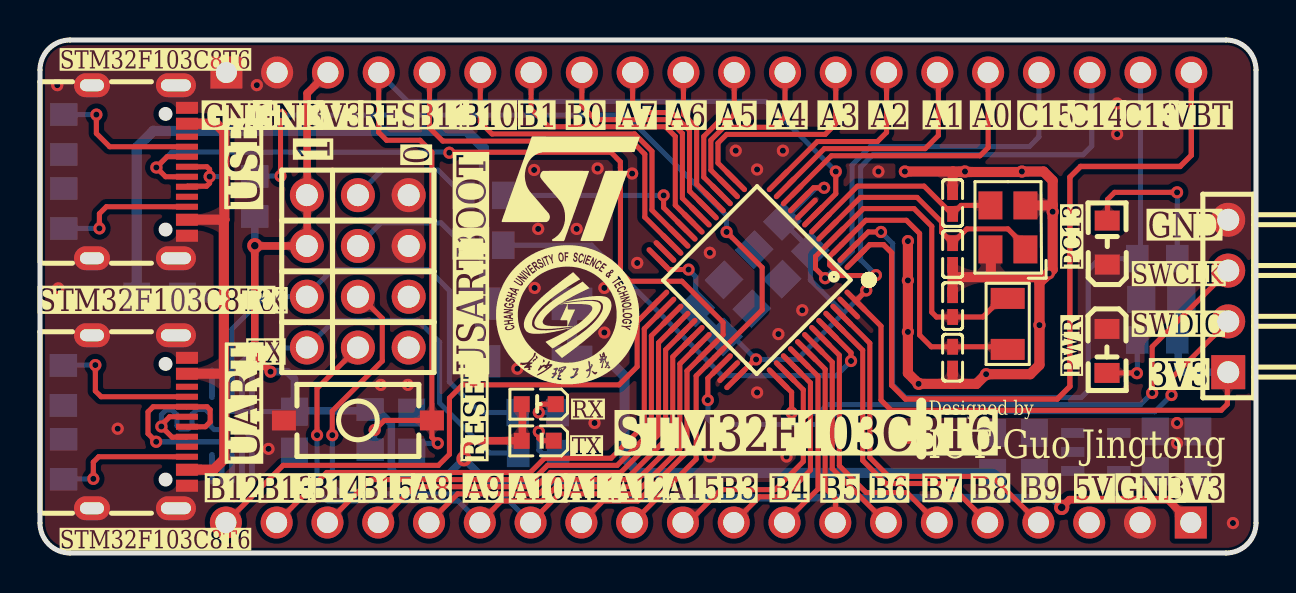
[diagram p2: board, top side]
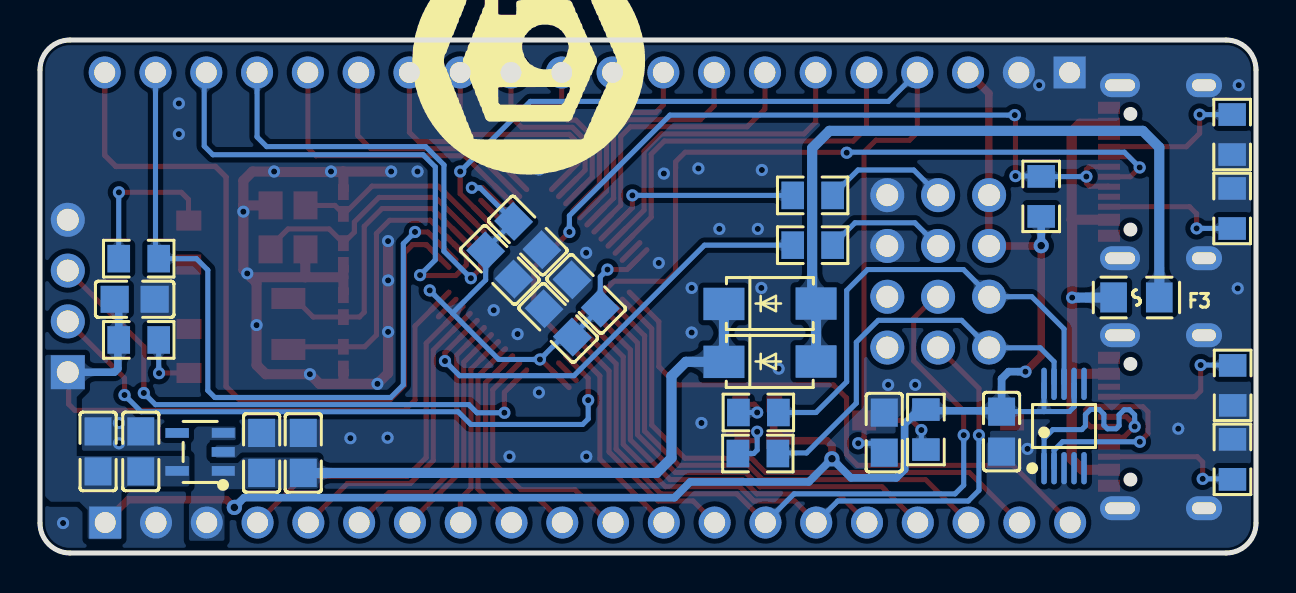
[diagram p3: board, bottom side, seen from below]

Outline 60.82 x 25.65 mm; copper layers: Top Layer, Bottom Layer. Coordinates in mm from the lower left corner of the outline.
Outline path: 0,24.15 0,1.5 arc(0.44,0.44) 1.5,0 59.32,0 arc(60.38,0.44) 60.82,1.5 60.82,24.15 arc(60.38,25.21) 59.32,25.65 1.5,25.65 arc(0.44,25.21) 0,24.15
Stack: Top Layer 0.035mm / Dielectric1 1.51mm FR4 er 4.5 / Bottom Layer 0.035mm

## Design rules (mm)
net CH_USB_D+: DP2
net CH_USB_D-: DP2
net USB_D+_PA12: DP1
net USB_D-_PA11: DP1
template: 自定义配置
spacing copperThickness1oz (default): track to track 0.102, other pairs 0.152 to 0.3
spacing copperThickness2oz: track to track 0.203, other pairs 0.152 to 0.3
track width copperThickness1oz (default): min 0.127, default 0.254, max 2.54
track width copperThickness2oz: min 0.203, default 0.254, max 2.54
differential pair differentialPair (default): width min 0.127, default 0.254, max 2.54; gap min 0.152, default 0.152
via viaSize (default): diameter min 0.5, default 0.61, max 10; hole min 0.3, default 0.305, max 6.3

## Placement (name value [footprint] x y rotation side)
C1  1uF  [C0805]  47.65 5 270 bottom
C2  100nF  [C0805]  49.73 5 270 bottom
C3  100nF  [C0805]  55.78 5.08 270 bottom
C4  1uF  [C0805]  57.91 5.08 270 bottom
C5  100nF  [C0805]  18.59 6.02 270 bottom
C6  100nF  [C0805]  37.82 14.4 45 bottom
C7  100nF  [C0805]  36.42 15.87 45 bottom
C8  100nF  [C0805]  33.5 12.95 225 bottom
C9  100nF  [C0805]  34.9 11.5 225 bottom
C10  100nF  [C0805]  56.08 12.69 0 bottom
C11  12pF  [C0402]  45.64 14.95 270 top
C12  12pF  [C0402]  45.64 9.77 90 top
C13  12pF  [C0402]  45.64 12.34 270 top
C14  12pF  [C0402]  45.64 17.5 270 top
C15  100nF  [C0805]  12.73 6.07 90 bottom
D2  SS54  [SMA_L4.3-W2.6-LS5.0-FD]  24.31 9.57 0 bottom
D3  SS54  [SMA_L4.3-W2.6-LS5.0-FD]  24.31 12.46 0 bottom
F3  BSMD0805-050-6V  [F0805]  5.98 12.78 0 bottom
H1  PZ254V-11-03P  [HDR-TH_3P-P2.54-V-M]  15.9 15.35 0 top
H2  PZ254V-11-03P  [HDR-TH_3P-P2.54-V-M]  15.9 17.89 0 top
H3  PH2.54-01-20PZD  [HDR-TH_20P-P2.54-V-M-4]  33.45 24.03 0 bottom
H4  PH2.54-01-20PZD  [HDR-TH_20P-P2.54-V-M-4]  33.43 1.52 180 bottom
H5  PZ2.54-1*4-WZ  [HDR-TH_4P-P2.54-H-M-W7.7-P]  59.43 12.85 90 top
H6  PZ254V-11-03P  [HDR-TH_3P-P2.54-V-M]  15.9 10.27 0 top
H7  PZ254V-11-03P  [HDR-TH_3P-P2.54-V-M]  15.9 12.81 0 top
LDO1  ME6211C33M5G-N  [SOT-23-5_L3.0-W1.7-P0.95-LS2.8-BL]  52.81 5.05 90 bottom
PC13  XL-2012UBC  [LED0805-RD]  53.38 15.52 90 top
PWR  XL-2012SURC  [LED0805-RD_RED]  53.37 10.1 270 top
R5  10kΩ  [R0805]  16.51 6.17 90 bottom
R6  10kΩ  [R0805]  22.17 15.39 0 bottom
R7  10kΩ  [R0805]  22.17 17.88 180 bottom
R9  5.1kΩ  [R0805]  1.18 4.68 90 bottom
R10  5.1kΩ  [R0805]  1.17 8.38 270 bottom
R12  1kΩ  [R0805]  24.91 4.97 0 bottom
R13  1kΩ  [R0805]  24.89 7.03 0 bottom
R14  5.1kΩ  [R0805]  1.19 17.23 90 bottom
R15  5.1kΩ  [R0805]  1.19 20.92 270 bottom
R16  1.5kΩ  [R0805]  10.74 17.83 270 bottom
R17  1kΩ  [R0805]  55.88 14.72 180 bottom
R18  1kΩ  [R0805]  55.88 10.65 0 bottom
RESET  TS-1101-B-W  [KEY-SMD_2P-L6.0-W3.6-P7.4-LS8.0-L]  15.9 6.63 0 top
RX  XL-1608UBC-06A  [LED0603-R-RD]  24.94 7.44 180 top
TX  XL-1608PGC-06  [LED0603-RD_GREEN]  24.89 5.61 180 top
U1  STM32F103C8T6  [LQFP-48_L7.0-W7.0-P0.50-LS9.0-BL]  35.85 13.66 135 top
U2  CH340E  [MSOP-10_L3.0-W3.0-P0.50-LS5.0-BL]  9.6 6.35 180 bottom
UART  TYPE-C 16PIN 2MD(073)  [USB-C-SMD_TYPE-C-6PIN-2MD-073]  4.98 6.56 270 top
USB  TYPE-C 16PIN 2MD(073)  [USB-C-SMD_TYPE-C-6PIN-2MD-073]  4.98 19.06 270 top
X1  32.768kHz  [OSC-SMD_L3.2-W1.5]  48.4 11.45 90 top
X2  8MHz  [CRYSTAL-SMD_4P-L3.2-W2.5-BL-1]  48.41 16.28 90 top

## Footprints (pads in the part's own frame, mm; a bottom-side part is the same pattern mirrored in y, then rotated)
C0402
  rect 0.79x0.54 smd: 1(-0.545,0) 2(0.545,0)
C0805
  rect 1.41x1.35 smd: 1(-1,0) 2(1,0)
CRYSTAL-SMD_4P-L3.2-W2.5-BL-1
  rect 1.4x1.2 smd: 1(-1.1,-0.875) 2(1.1,-0.875) 3(1.1,0.875) 4(-1.1,0.875)
F0805
  rect 1.335x1.5 smd: 1(-1.143,0) 2(1.143,0)
HDR-TH_3P-P2.54-V-M
  round 1.7 hole 1.1: 1(-2.552,0.003) 2(0,0) 3(2.54,0)
HDR-TH_4P-P2.54-H-M-W7.7-P
  rect 1.7x1.7 hole 1.1: 1(-3.81,0)
  round 1.7 hole 1.1: 2(-1.27,0) 3(1.27,0) 4(3.81,0)
HDR-TH_20P-P2.54-V-M-4
  rect 1.6x1.6 hole 1.05: 1(-24.13,0)
  round 1.6 hole 1.05: 2(-21.59,0) 3(-19.05,0) 4(-16.51,0) 5(-13.97,0) 6(-11.43,0) 7(-8.89,0) 8(-6.35,0) 9(-3.81,0) 10(-1.27,0) 11(1.27,0) 12(3.81,0) 13(6.35,0) 14(8.89,0) 15(11.43,0) 16(13.97,0) 17(16.51,0) 18(19.05,0) 19(21.59,0) 20(24.13,0)
KEY-SMD_2P-L6.0-W3.6-P7.4-LS8.0-L
  rect 1.2x1 smd: 1(-3.7,0) 2(3.7,0)
LED0603-R-RD
  rect 0.8x0.8 smd: 1(0.851,0) 2(-0.851,0)
LED0603-RD_GREEN
  rect 0.8x0.8 smd: 1(-0.799,-0.004) 2(0.799,0.004)
LED0805-RD
  rect 1x1.25 smd: 1(-1.1,0) 2(1.1,0)
LED0805-RD_RED
  rect 1x1.25 smd: 1(-1.1,0) 2(1.1,0)
LQFP-48_L7.0-W7.0-P0.50-LS9.0-BL
  oval 0.27x1.5 smd: 1(-2.75,-4.25) 2(-2.25,-4.25) 3(-1.75,-4.25) 4(-1.25,-4.25) 5(-0.75,-4.25) 6(-0.25,-4.25) 7(0.25,-4.25) 8(0.75,-4.25) 9(1.25,-4.25) 10(1.75,-4.25) 11(2.25,-4.25) 12(2.75,-4.25) 25(2.75,4.25) 26(2.25,4.25) 27(1.75,4.25) 28(1.25,4.25) 29(0.75,4.25) 30(0.25,4.25) 31(-0.25,4.25) 32(-0.75,4.25) 33(-1.25,4.25) 34(-1.75,4.25) 35(-2.25,4.25) 36(-2.75,4.25)
  oval 1.5x0.27 smd: 13(4.25,-2.75) 14(4.25,-2.25) 15(4.25,-1.75) 16(4.25,-1.25) 17(4.25,-0.75) 18(4.25,-0.25) 19(4.25,0.25) 20(4.25,0.75) 21(4.25,1.25) 22(4.25,1.75) 23(4.25,2.25) 24(4.25,2.75) 37(-4.25,2.75) 38(-4.25,2.25) 39(-4.25,1.75) 40(-4.25,1.25) 41(-4.25,0.75) 42(-4.25,0.25) 43(-4.25,-0.25) 44(-4.25,-0.75) 45(-4.25,-1.25) 46(-4.25,-1.75) 47(-4.25,-2.25) 48(-4.25,-2.75)
MSOP-10_L3.0-W3.0-P0.50-LS5.0-BL
  oval 0.28x1.62 smd: 1(-1,-2.11) 2(-0.5,-2.11) 3(0,-2.11) 4(0.5,-2.11) 5(1,-2.11) 6(1,2.11) 7(0.5,2.11) 8(0,2.11) 9(-0.5,2.11) 10(-1,2.11)
OSC-SMD_L3.2-W1.5
  rect 1.05x1.7 smd: 1(-1.275,0) 2(1.275,0)
R0805
  rect 1.133x1.377 smd: 1(-1,0) 2(1,0)
SMA_L4.3-W2.6-LS5.0-FD
  rect 2.046x1.62 smd: 1(-2.304,-0.009) 2(2.304,0.009)
SOT-23-5_L3.0-W1.7-P0.95-LS2.8-BL
  rect 0.49x1.157 smd: 1(-0.95,-1.153) 2(0,-1.153) 3(0.95,-1.153)
  rect 0.49x1.175 smd: 4(0.95,1.153) 5(-0.95,1.153)
USB-C-SMD_TYPE-C-6PIN-2MD-073
  rect 0.6x1.1 smd: 1(-3.2,2.375) 2(-2.4,2.375) 11(2.4,2.375) 12(3.2,2.375)
  rect 0.3x1.1 smd: 3(-1.75,2.375) 4(-1.25,2.375) 5(-0.75,2.375) 6(-0.25,2.375) 7(0.25,2.375) 8(0.75,2.375) 9(1.25,2.375) 10(1.75,2.375)
  oval 1.2x2 hole 0.6x1.5: 13(-4.325,1.825) 14(4.325,1.825)
  oval 1.2x1.8 hole 0.6x1.2: 13(-4.325,-2.375) 14(4.325,-2.375)

## Nets
3V3: C3.2 C4.2 C6.2 C7.2 C8.2 C9.2 C10.2 C15.2 H1.1 H2.1 H3.3 H4.1 H5.1 LDO1.5 R5.2 R16.2 R18.2 RX.1 TX.2 U1.9 U1.24 U1.36 U1.48 U2.7 U2.10
+5V: C1.2 C2.2 D2.2 D3.2 H4.3 LDO1.1 LDO1.3
GND: C1.1 C2.1 C3.1 C4.1 C5.1 C6.1 C7.1 C8.1 C9.1 C10.1 C11.2 C12.1 C13.1 C14.1 C15.1 H1.3 H2.3 H3.1 H3.2 H4.2 H5.4 LDO1.2 PC13.1 PWR.1 R9.2 R10.2 R14.2 R15.2 RESET.1 U1.8 U1.23 U1.35 U1.47 U2.3 UART.1 UART.12 UART.13 UART.14 USB.1 USB.12 USB.13 USB.14 X2.2 X2.4
VBAT: H3.20 U1.1
VBUS_5V: F3.2 UART.2 UART.11 USB.2 USB.11
BOOT0: R6.2 U1.44
BOOT1: R7.1 U1.20
CH_RX: H7.1 R13.1 U2.8
CH_TX: H6.1 R12.1 U2.9
CH_USB_D+: U2.1 UART.6 UART.8
CH_USB_D-: U2.2 UART.5 UART.7
IN_5V: D2.1 D3.1 F3.1
NRST: C5.2 H3.4 R5.1 RESET.2 U1.7
OSC32_IN: C12.2 H3.18 U1.3 X1.1
OSC32_OUT: C13.2 H3.17 U1.4 X1.2
OSC_IN: C11.1 U1.5 X2.1
OSC_OUT: C14.2 U1.6 X2.3
PA0: H3.16 U1.10
PA1: H3.15 U1.11
PA2: H3.14 U1.12
PA3: H3.13 U1.13
PA4: H3.12 U1.14
PA5: H3.11 U1.15
PA6: H3.10 U1.16
PA7: H3.9 U1.17
PA8: H4.16 U1.29
PA9/USART1_TX: H4.15 H6.2 U1.30
PA10/USART1_RX: H4.14 H7.2 U1.31
PA13/SWDIO: H5.2 U1.34
PA14/SWCLK: H5.3 U1.37
PA15: H4.11 U1.38
PB0: H3.8 U1.18
PB1: H3.7 U1.19
PB3: H4.10 U1.39
PB4: H4.9 U1.40
PB5: H4.8 U1.41
PB6: H4.7 U1.42
PB7: H4.6 U1.43
PB8: H4.5 U1.45
PB9: H4.4 U1.46
PB10: H3.6 U1.21
PB11: H3.5 U1.22
PB12: H4.20 U1.25
PB13: H4.19 U1.26
PB14: H4.18 U1.27
PB15: H4.17 U1.28
PC13: H3.19 R17.2 U1.2
USB_D+_PA12: H4.12 R16.1 U1.33 USB.6 USB.8
USB_D-_PA11: H4.13 U1.32 USB.5 USB.7
$1N2343: PWR.2 R18.1
$1N2346: PC13.2 R17.1
$1N2538: H2.2 R7.2
$1N2559: H1.2 R6.1
$1N4249: R14.1 USB.10
$1N4261: R15.1 USB.4
$2N1745: R9.1 UART.10
$2N1757: R10.1 UART.4
$2N3004: R12.2 TX.1
$2N3008: R13.2 RX.2

Pads without a net: H6 3; H7 3; LDO1 4; U2 4 5 6; UART 3 9; USB 3 9

## Via types
v1: diameter 0.61, hole 0.305, Top Layer to Bottom Layer, 82 vias
v2: diameter 0.762, hole 0.381, Top Layer to Bottom Layer, 3 vias

## Routing (per net, layer and track width the routed paths; a pad name or vN(x,y) marks a point on that pad's centre or on a via; arc(x,y) is an arc through that point)
3V3: length 142.3
  Top Layer w0.254: U1.9 38.69,18.26 v1(39.22,18.26) ; H5.1 59.39,9 59.39,7.44 59.08,7.14 42.57,7.14 42.06,7.64 42.06,11.34 U1.48 41.33,13.12 v1(41.33,13.13) ; v1(35.81,9.68) 35.76,9.68 U1.36 ; v1(32.44,14.17) 31.46,14.17 30.91,14.72
  Top Layer w0.381: H4.1 56.41,2.67 51.49,2.67 v2(51.1,2.28) ; H3.3 13.36,22.98 13.36,15.35 10.76,15.35 v2(10.74,15.37) 10.74,9.85 v1(11.53,9.07) ; RX.1 24.13,7.4 24.13,5.61 21.46,5.61 21.21,5.36 v2(21.21,4.71)
  Bottom Layer w0.254: U2.10 10.6,7.07 ; 10.6,7.07 10.61,7.07 C15.2 ; 10.6,7.07 9.33,7.07 9.09,7.31 9.09,8.45 U2.7 ; v1(32.44,14.17) 32.8,13.81 C8.2 34.19,10.85 C9.2 34.69,10.8 v1(35.81,9.68) 37.87,9.68 40.19,11.99 ; 40.19,11.99 38.53,13.65 C6.2 38.53,15.18 37.13,16.58 38.81,18.26 v1(39.22,18.26) ; 40.19,11.99 v1(41.33,13.13)
  Bottom Layer w0.381: C10.2 56.88,12.48 R18.2 56.92,10.61 56.92,9.22 57.1,9.04 H5.1 ; R16.2 v2(10.74,15.37) ; v1(11.53,9.07) 12.37,9.07 12.73,8.71 C15.2 12.77,7.11 16.92,7.11 17.58,6.46 17.58,4.17 17.99,3.76 20.26,3.76 v2(21.21,4.71) 22.37,3.55 28.3,3.55 29.08,2.77 50.61,2.77 v2(51.1,2.28)
+5V: length 28.6
  Bottom Layer w0.508: C1.2 29.98,4 29.24,4.75 29.24,8.84 28.52,9.56 D2.2 D3.2
GND: length 42.2
  Top Layer w0.508: v1(43.41,13.63) v1(43.41,11.05) 43.41,8.99 v1(43.94,8.46) 45.62,8.46 ; X2.2 50.63,17.38 50.65,17.39 ; 50.27,13.79 v1(50.45,13.98) 50.65,14.17 v1(50.65,17.07) 50.65,17.39 ; 50.27,13.79 47.55,13.79 ; 50.27,13.79 49.99,13.51 v1(49.99,11.39) 49.99,9.4 49.53,8.94 v1(47.32,8.94) 46.84,8.46 45.62,8.46 ; 47.55,13.79 47.55,15.16 X2.4 ; 47.55,13.79 45.64,13.79 ; 45.62,8.46 45.64,8.48 C12.1 ; 45.64,13.79 C13.1 ; 45.64,13.79 C11.2 ; 45.64,19.05 49.08,19.05 v1(49.11,19.07) 50.19,19.07 50.65,18.62 50.65,17.39 ; 45.64,19.05 C14.1 ; 45.64,19.05 45.67,19.07 ; 45.67,19.07 v1(46.26,19.07) ; 45.67,19.07 v1(43.26,19.07) ; v1(43.41,15.59) 43.41,13.63
  vias: v1(0.86,23.39) v1(0.91,13.23) v1(3.89,6.21) v1(10.85,23.39) v1(11.43,5.21) v1(17.04,8.41) v1(18.4,8.41) v1(23.88,9.22) v1(24.71,19.15) v1(24.74,13.25) v1(24.92,16.2) v1(26.84,16.2) v1(27.74,6.5) v1(27.89,19.23) v1(28.23,13.25) v1(28.23,11.02) v1(29.62,18.97) v1(29.87,14.5) v1(33.5,15.01) v1(33.5,4.83) v1(34.8,20.12) v1(35.86,19.18) v1(35.86,8.03) v1(36.93,10.95) v1(37.16,20.12) v1(37.34,4.83) v1(38.13,12.14) v1(41.94,19.07) v1(43.43,5.77) v1(45.29,5.74) v1(53.87,22.48) v1(53.87,20.94) v1(56.87,6.5) v1(56.87,5.49) v1(59.66,1.5)
VBAT: length 39.5
  Top Layer w0.269: U1.1 41.5,15.42 42.19,15.42 42.6,15.01 42.6,8.39 43.29,7.69 50.88,7.69 51.51,8.33 51.51,18.8 52.04,19.33 57.02,19.33 57.58,19.89 H3.20
VBUS_5V: length 26.6
  Top Layer w0.508: 9.22,16.66 9.2,16.64 v1(9.2,12.77) 9.2,8.99 9.22,8.97 ; 9.22,16.66 9.22,16.67 9.22,21.06 8.81,21.46 USB.2 ; 9.22,16.66 USB.11 ; 9.22,8.97 9.22,4.7 8.69,4.16 UART.11 ; 9.22,8.97 9.22,8.96 UART.2
  Bottom Layer w0.508: v1(9.2,12.77) 6.82,12.77 6.82,12.78
BOOT0: length 22.5
  Top Layer w0.254: U1.44 40.56,10.01 v1(40.56,9.6)
  Bottom Layer w0.254: v1(40.56,9.6) 39.83,8.86 34.11,8.86 27.58,15.39 R6.2
BOOT1: length 10.2
  Top Layer w0.254: U1.20 31.19,17.27 v1(31.19,17.88)
  Bottom Layer w0.254: R7.1 v1(31.19,17.88)
CH_RX: length 23.9
  Bottom Layer w0.254: U2.8 9.6,11.2 11.22,12.81 13.35,12.81 13.35,12.89 14.63,14.17 19.43,14.17 20.47,13.13 20.47,8.56 22.01,7.03 R13.1
CH_TX: length 20.3
  Bottom Layer w0.254: U2.9 10.1,9.57 10.8,10.26 13.35,10.26 14.72,11.63 18.9,11.63 19.99,10.54 19.99,7.49 22.48,5 23.89,5 R12.1
CH_USB_D+: length 12.1
  Top Layer w0.254: UART.6 6.48,6.81 6.07,6.4 v1(6.07,6.32) 6.6,5.79 7.33,5.79 UART.8
  Bottom Layer w0.254: v1(6.07,6.32) 6.07,6.91 6.32,7.16 6.59,7.16 6.85,6.91 6.85,6.36 7,6.21 7.43,6.21 7.61,6.39 7.61,6.94 7.85,7.18 8.28,7.18 8.53,6.92 8.53,6.35 8.71,6.17 10.16,6.17 10.6,5.73 U2.1
CH_USB_D-: length 12.2
  Top Layer w0.254: v1(5.81,5.56) 5.41,5.97 5.41,7.06 5.66,7.31 UART.5 8.36,7.31 8.51,7.16 8.51,6.55 8.27,6.31 UART.7
  Bottom Layer w0.254: v1(5.81,5.56) 9.68,5.56 10.1,5.14 U2.2
IN_5V: length 36.3
  Bottom Layer w0.508: F3.1 4.84,20.28 5.66,21.11 21.34,21.11 22.2,20.24 22.2,12.67 D3.1 D2.1
NRST: length 54
  Top Layer w0.254: RESET.2 19.6,20.05 19.01,20.64 17.34,20.64 16.94,21.03 H3.4 ; RESET.2 17.22,6.63 v1(16.74,6.15) ; RESET.2 19.6,5.78 v1(19.9,5.49) ; U1.7 39.8,17.96 v1(39.8,19.07)
  Bottom Layer w0.254: v1(16.74,6.15) 16.74,5.35 16.92,5.17 ; v1(39.8,19.07) 36.3,22.58 18.39,22.58 H3.4 ; v1(19.9,5.49) 19.06,5.49 C5.2
OSC32_IN: length 39.7
  Top Layer w0.254: v1(41.81,13.89) 41.79,13.87 40.02,13.87 39.5,14.4 39.5,14.83 40.09,15.43 U1.3 41.3,16.64 43.33,16.64 43.99,15.98 43.99,10.9 44.58,10.31 C12.2 48.27,10.31 X1.1
  Bottom Layer w0.254: H3.18 52.61,23.92 52.61,20.35 52.17,19.91 41.66,19.91 41.05,19.3 41.05,14.66 v1(41.81,13.89)
OSC32_OUT: length 36.4
  Top Layer w0.254: v1(39.27,13.74) 38.79,14.22 38.79,14.83 U1.4 41.18,17.22 43.71,17.22 44.6,16.33 44.6,12.04 44.84,11.8 C13.2 47.16,11.8 48.09,12.73 X1.2
  Bottom Layer w0.254: v1(39.27,13.74) 40.61,15.09 40.61,19.4 41.53,20.32 49.48,20.32 49.96,20.8 H3.17
OSC_IN: length 12.6
  Top Layer w0.254: X2.1 49.29,15.33 48.41,16.2 46.36,16.2 C11.1 45.1,16.04 45.1,16.55 43.87,17.78 41.03,17.78 U1.5
OSC_OUT: length 10
  Top Layer w0.254: 39.04,16.49 40.89,18.34 44.22,18.34 45.6,16.95 C14.2 46.07,17.38 X2.3
PA0: length 14.5
  Top Layer w0.254: U1.10 39.58,19.86 47.02,19.86 47.42,20.27 H3.16
PA1: length 11.9
  Top Layer w0.254: 37.27,18.26 39.23,20.22 44.27,20.22 44.93,20.88 44.93,23.97 H3.15
PA2: length 9.4
  Top Layer w0.254: H3.14 42.34,21.03 41.88,20.57 38.88,20.57 U1.12
PA3: length 11.1
  Top Layer w0.254: U1.13 33.91,19.5 33.91,20.5 34.34,20.93 39.27,20.93 39.8,21.46 H3.13
PA4: length 9.2
  Top Layer w0.254: H3.12 37.26,21.82 36.73,21.29 34.19,21.29 33.55,20.64 33.55,19.15 U1.14
PA5: length 7.4
  Top Layer w0.254: U1.15 33.2,18.79 33.2,20.83 34.01,21.64 34.44,21.64 34.72,21.92 H3.11
PA6: length 7.1
  Top Layer w0.254: U1.16 32.84,18.44 32.84,21.27 32.18,21.93 H3.10
PA7: length 9.3
  Top Layer w0.254: U1.17 32.49,18.09 32.49,21.12 31.59,22.02 30.02,22.02 29.64,22.4 H3.9
PA8: length 19.5
  Top Layer w0.254: U1.29 31.29,10.16 31.29,5.66 29.3,3.67 25.68,3.67 24.96,2.96 20.89,2.96 H4.16
PA9/USART1_TX: length 33.9
  Top Layer w0.254: 32.67,10.83 31.65,9.81 31.65,5.43 29.53,3.31 25.82,3.31 25.11,2.6 23.08,2.6 H4.15 ; v1(13.86,5.89) 13.86,8.23 H6.2
  Bottom Layer w0.254: v1(13.86,5.89) 13.86,3.13 14.39,2.6 20.92,2.6 H4.15
PA10/USART1_RX: length 36.4
  Top Layer w0.254: H7.2 16.04,12.81 17.12,11.73 17.12,9.6 14.62,7.1 v1(14.62,5.89) ; U1.31 32,9.46 32,5.2 29.76,2.96 25.97,2.96 H4.14
  Bottom Layer w0.254: v1(14.62,5.89) 14.62,3.39 15.05,2.96 23.1,2.96 H4.14
PA13/SWDIO: length 31.8
  Top Layer w0.254: H5.2 56.59,8.74 v1(56.59,7.9) ; U1.34 33.4,8.73 v1(33.4,7.64)
  Bottom Layer w0.254: v1(56.59,7.9) 55.76,7.06 39.91,7.06 39.27,6.43 33.68,6.43 33.4,6.7 v1(33.4,7.64)
PA14/SWCLK: length 28.1
  Top Layer w0.254: H5.3 55.63,10.32 v1(55.63,8) ; v1(37.59,7.01) 37.59,8.04 U1.37
  Bottom Layer w0.254: v1(37.59,7.01) 38.97,7.01 39.37,7.42 55.05,7.42 v1(55.63,8)
PA15: length 12.3
  Top Layer w0.254: 32.16,1.27 34.05,3.17 36.77,3.17 38.18,4.58 38.18,8.16 37.27,9.07
PB0: length 11.8
  Top Layer w0.254: U1.18 32.13,17.74 32.13,20.98 31.44,21.67 27.79,21.67 27.1,22.35 H3.8
PB1: length 14.3
  Top Layer w0.254: 32.67,16.49 31.77,17.39 31.77,20.83 31.29,21.31 25.45,21.31 24.56,22.2 H3.7
PB3: length 10.6
  Top Layer w0.254: H4.10 35.98,2.81 37.2,2.81 38.53,4.14 38.53,8.51 U1.39
PB4: length 9.3
  Top Layer w0.254: U1.40 38.91,8.84 38.91,3.2 H4.9
PB5: length 9.2
  Top Layer w0.254: H4.8 39.79,1.54 39.79,2.71 39.27,3.23 39.27,9.19 38.33,10.13
PB6: length 10.5
  Top Layer w0.254: H4.7 39.62,4.22 39.62,9.54 U1.42
PB7: length 12.9
  Top Layer w0.254: H4.6 43.36,3.02 41.32,3.02 39.98,4.36 39.98,9.89 U1.43
PB8: length 15
  Top Layer w0.254: U1.45 41.15,10.14 41.15,4.63 42.3,3.47 45.44,3.47 H4.5
PB9: length 17.5
  Top Layer w0.254: 40.1,11.89 41.5,10.49 41.5,4.77 42.45,3.83 47.63,3.83 H4.4
PB10: length 16.5
  Top Layer w0.254: H3.6 22.02,21.54 22.61,20.95 29.74,20.95 30.61,20.09 30.61,17.14 U1.21
PB11: length 19.2
  Top Layer w0.254: U1.22 30.25,16.79 30.25,19.94 29.59,20.6 20.14,20.6 19.48,21.26 H3.5
PB12: length 29.2
  Top Layer w0.254: 30.91,12.6 29.87,11.56 29.87,9.32 28.96,8.41 21.13,8.41 20.48,7.75 20.48,4.93 19.93,4.38 12.16,4.38 H4.20
PB13: length 26.7
  Top Layer w0.254: U1.26 30.22,11.21 30.22,6.4 28.56,4.74 25.23,4.74 24.52,4.03 14.34,4.03 H4.19
PB14: length 24.3
  Top Layer w0.254: H4.18 16.52,3.67 24.67,3.67 25.38,4.38 28.87,4.38 30.58,6.09 30.58,10.86 31.61,11.89
PB15: length 21.9
  Top Layer w0.254: U1.28 30.94,10.51 30.94,5.92 29.05,4.03 25.53,4.03 24.82,3.31 18.71,3.31 H4.17
PC13: length 38.2
  Top Layer w0.254: v1(42.06,16.05) 41.43,16.05 U1.2
  Bottom Layer w0.254: H3.19 55.04,14.88 R17.2 53,14.72 52.43,14.15 52.43,8.13 52.07,7.78 43.28,7.78 42.65,8.41 42.65,15.47 v1(42.06,16.05)
USB_D+_PA12: length 52.8
  Top Layer w0.254: USB.8 7.38,18.34 8.33,18.34 8.48,18.49 v1(8.48,18.82) 8.48,19.18 8.35,19.31 USB.6 ; v1(12.03,18.85) 12.03,21.86 v1(12.07,21.89) ; H4.12 29.65,1.52 32.82,4.69 32.82,8.86 U1.33 36.12,12.16 36.12,14.27 v1(34.34,16.05)
  Bottom Layer w0.254: v1(34.34,16.05) 34.34,16.86 29.31,21.89 v1(12.07,21.89) ; 10.74,18.82 v1(8.48,18.82) ; R16.1 10.76,18.85 v1(12.03,18.85)
USB_D-_PA11: length 52.9
  Top Layer w0.254: USB.7 6.28,18.81 v1(5.82,19.28) 6.36,19.81 USB.5 ; H4.13 28.16,2.6 29.91,2.6 32.36,5.05 32.36,9.11 33.38,10.13 34.16,10.91 34.16,11.53 32.11,13.59 29.49,13.59 29.03,14.05 29.03,19.26 29.03,19.26 29.03,19.56 28.55,20.04 20.5,20.04 v1(20.47,20.01)
  Bottom Layer w0.254: v1(20.47,20.01) 20.45,20.04 6.58,20.04 v1(5.82,19.28)
$1N2343: length 3.2
  Top Layer w0.254: v1(54.86,8.99) 54.85,9 PWR.2
  Bottom Layer w0.254: v1(54.86,8.99) 54.88,9.01 R18.1
$1N2346: length 8
  Top Layer w0.254: 53.38,16.62 53.39,16.64 53.39,17.68 53.75,18.03 v1(56.87,18.03)
  Bottom Layer w0.254: v1(56.87,18.03) 56.88,18.02 R17.1
$1N2538: length 6.3
  Bottom Layer w0.254: H2.2 15.9,17.93 17.12,19.15 19.9,19.15 R7.2
$1N2559: length 6.2
  Bottom Layer w0.254: H1.2 17.06,16.51 20.06,16.51 R6.1
$1N4249: length 7
  Top Layer w0.254: USB.10 3.32,17.31 2.97,16.97 v1(2.97,16.23)
  Bottom Layer w0.254: R14.1 1.2,16.23 v1(2.97,16.23)
$1N4261: length 7.4
  Top Layer w0.254: USB.4 3.49,20.31 2.82,20.98 v1(2.82,21.92)
  Bottom Layer w0.254: R15.1 1.2,21.92 v1(2.82,21.92)
$2N1745: length 7.1
  Top Layer w0.254: v1(2.67,3.71) 2.67,4.55 2.93,4.81 UART.10
  Bottom Layer w0.254: v1(2.67,3.71) 1.2,3.71 R9.1
$2N1757: length 7.6
  Top Layer w0.254: UART.4 3.06,7.81 2.77,8.1 v1(2.77,9.4)
  Bottom Layer w0.254: R10.1 1.19,9.4 v1(2.77,9.4)
$2N3004: length 3.1
  Top Layer w0.254: TX.1 25.07,5.62 24.95,5.74 v1(24.95,6.06)
  Bottom Layer w0.254: v1(24.95,6.06) 24.95,5.15 25.12,4.97 R12.2
$2N3008: length 2.1
  Top Layer w0.254: RX.2 25.1,7.44 24.95,7.3 v1(24.95,7.03)
  Bottom Layer w0.254: R13.2 v1(24.95,7.03)

## Copper pours and planes (outline as drawn; the poured copper is in the pictures)
3V3 on Bottom Layer: 58.57,9.91 58.57,8.2 58.98,7.8 58.98,4.85 53.34,4.85 53.34,3.33 56.44,3.33 56.74,3.02 56.74,0.69 58.44,0.69 58.44,2.15 58.85,2.56 60.29,2.56 60.58,2.85 60.58,9.91
+5V on Bottom Layer: 46.91,4.77 50.65,4.77 50.93,4.5 52.31,4.5 52.31,5.62 52.32,5.64 51.02,5.64 51.02,6.31 51,6.32 52.96,6.32 53.26,6.02 53.26,2.54 53.37,2.44 53.37,0.61 53.29,0.61 51.61,0.61 51.59,0.63 51.59,3.2 46.89,3.2 46.89,4.75
GND on Top Layer: -2.93,28.02 62.37,28.02 62.37,-2.28 -2.93,-2.28
GND on Bottom Layer: -2.36,26.88 62.23,26.88 62.23,-1.01 -2.36,-1.01

Small or netless copper shapes (teardrops, artwork), in the pictures only: 136 on Top Layer, 103 on Bottom Layer

## Text on the board
Top Silkscreen Layer: STM32F103C8T6 | SWCLK | SWDIO | TX | RX | GND | B12 | B13 | 3V3 | B14 | RES | B15 | A8 | B11 | B10 | A9 | A10 | B1 | B0 | A11 | A12 | A7 | A15 | A6 | A5 | B3 | A4 | B4 | A3 | B5 | B6 | A2 | B7 | A1 | B8 | A0 | C15 | B9 | C14 | 5V | C13 | VBT | 0 | IOT-Guo Jingtong | BOOT | USART1 | 1 | Designed by
